# Altium schematic sheet 假肢控制电路.SchDoc
size A1
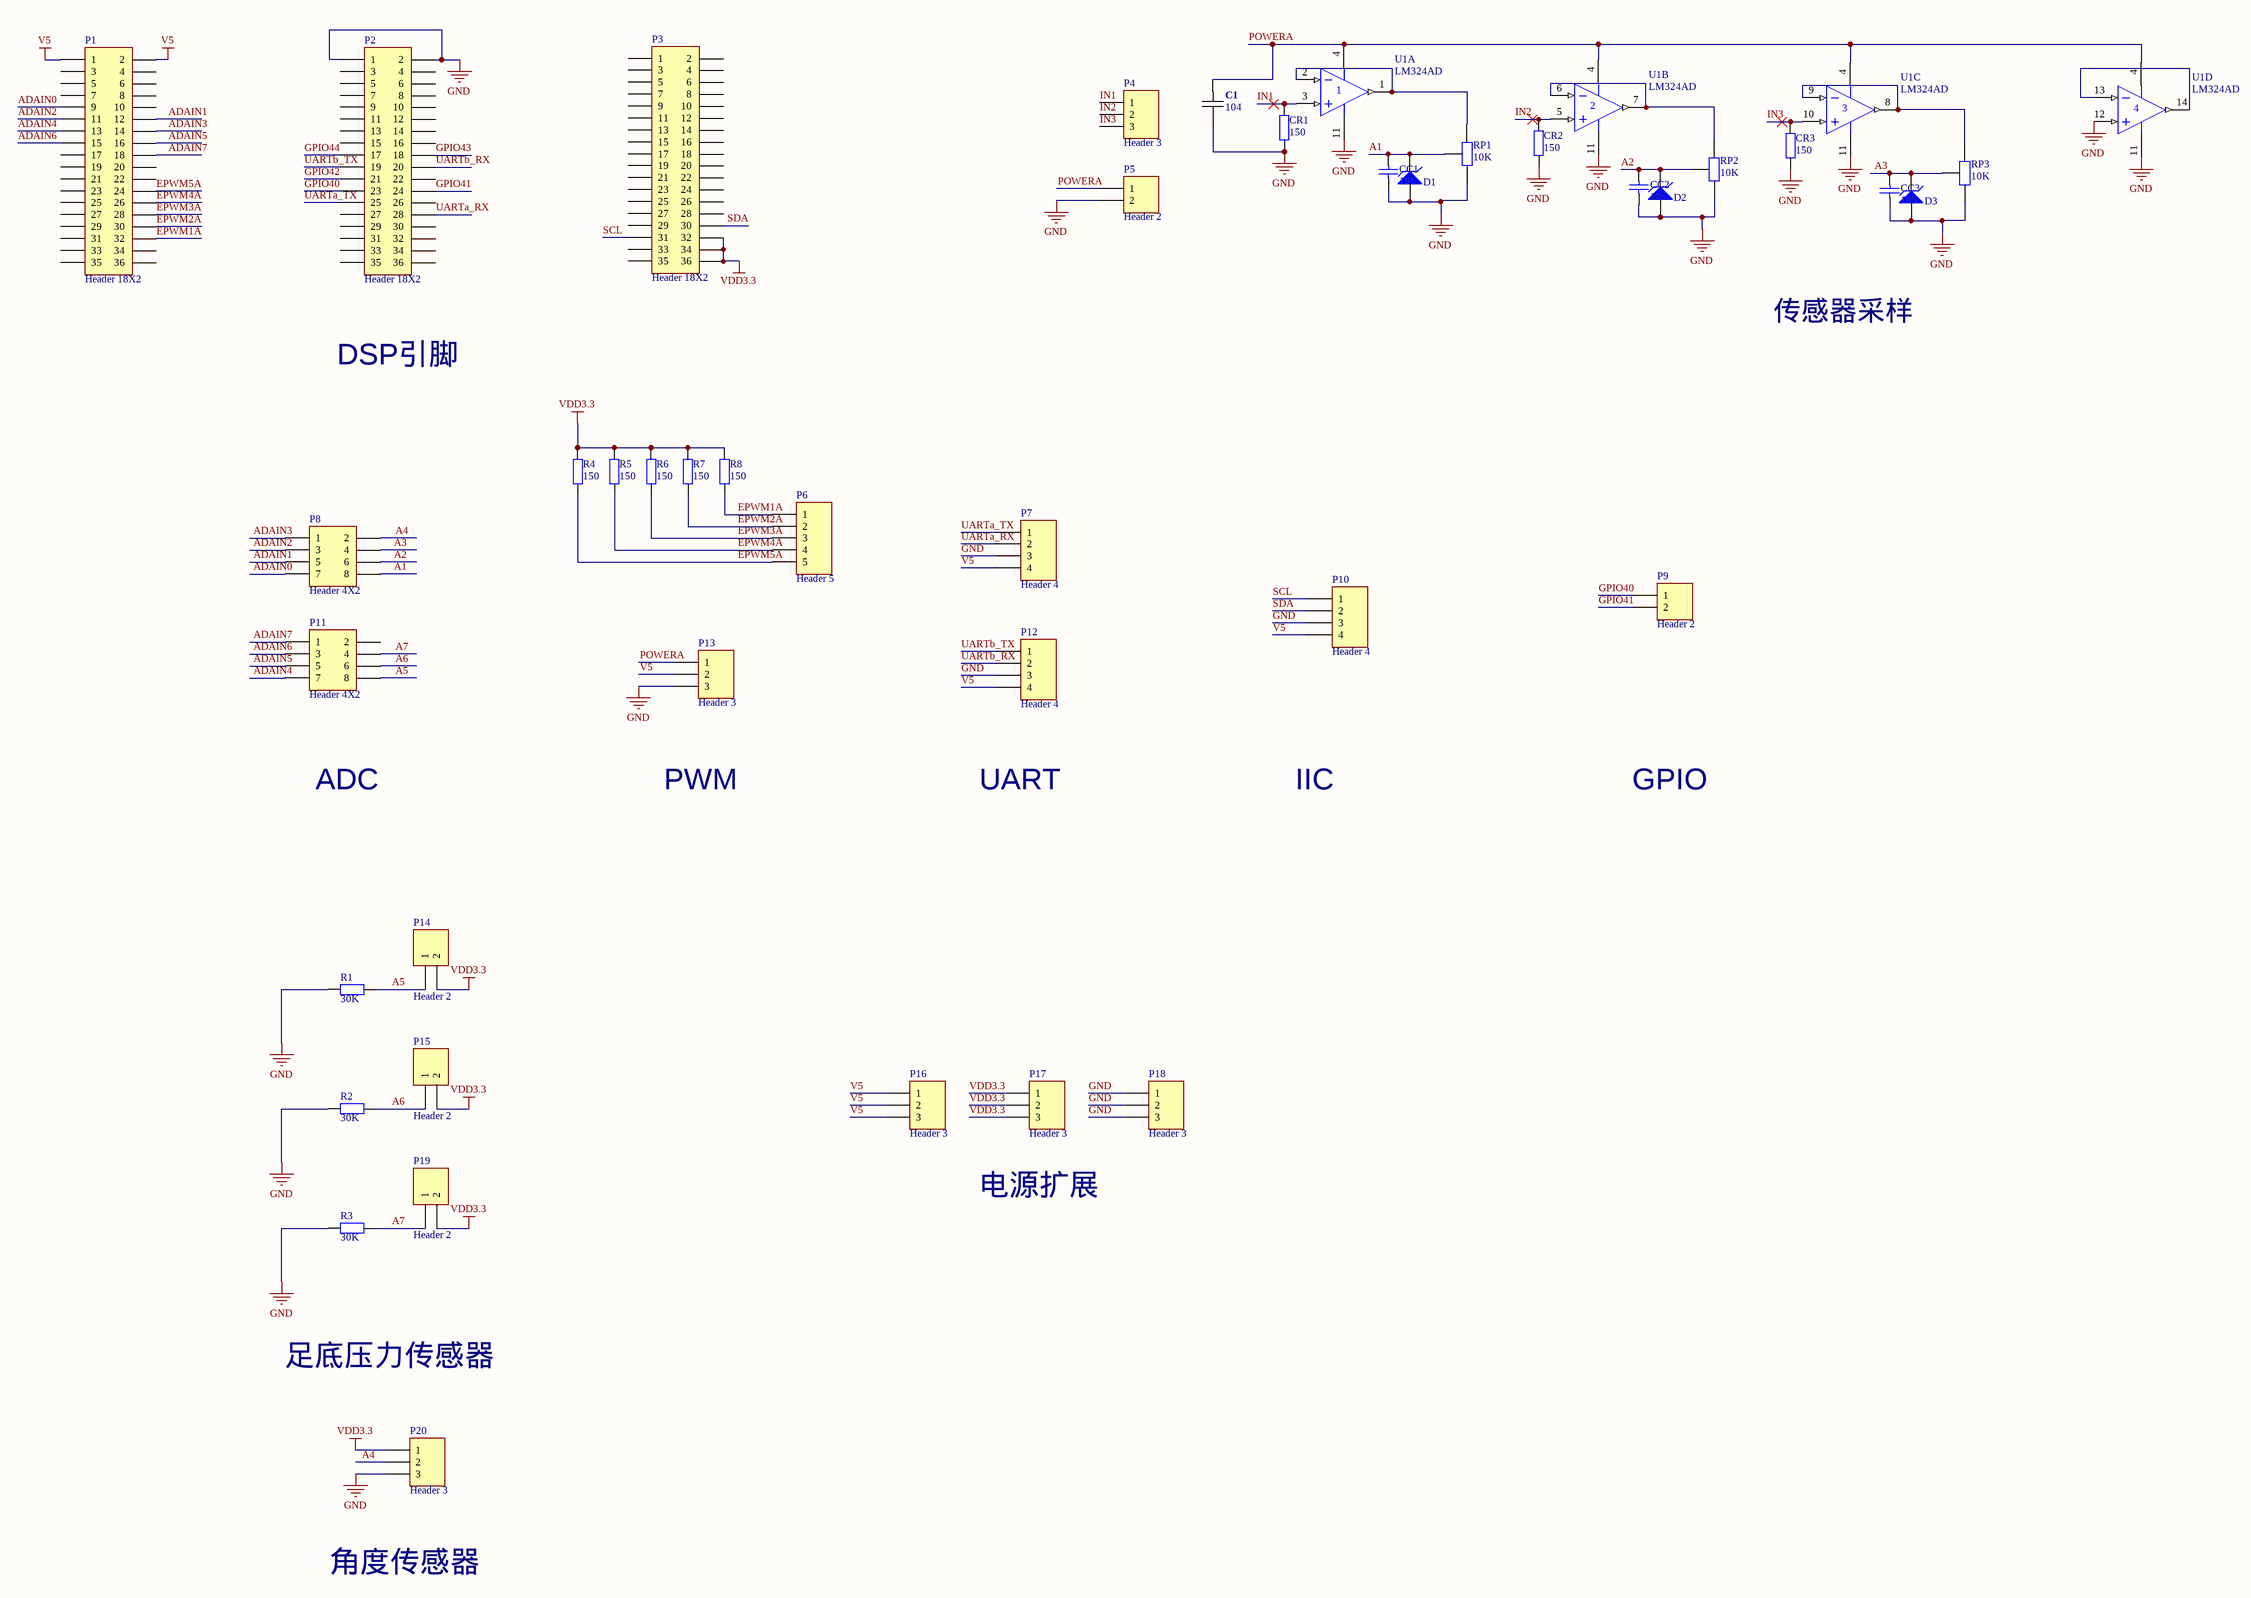
[diagram p0: 假肢控制电路.SchDoc]

## Parts
C1  104  [LC-0805_C]
CC1  105  [LC-0805_C]
CC2  105  [LC-0805_C]
CC3  105  [LC-0805_C]
CR1  150  [LC-0805_R]
CR2  150  [LC-0805_R]
CR3  150  [LC-0805_R]
D1  Diode  Zener  [LC-1206]  (value not drawn)
D2  Diode  Zener  [LC-1206]  (value not drawn)
D3  Diode  Zener  [LC-1206]  (value not drawn)
P1  Header 18X2  [HDR2X18]
P2  Header 18X2  [HDR2X18]
P3  Header 18X2  [HDR2X18]
P4  Header 3  [XH2.54-3]
P5  Header 2  [XH2.54-2]
P6  Header 5  [XH2.54-LI-5P]
P7  Header 4  [HDR1X4]
P8  Header 4X2  [HDR2X4]
P9  Header 2  [HDR1X2]
P10  Header 4  [KF2EDGK5.0-LI-4P]
P11  Header 4X2  [HDR2X4]
P12  Header 4  [HDR1X4]
P13  Header 3  [XH2.54-LI-3P]
P14  Header 2  [XH2.54-2]
P15  Header 2  [XH2.54-2]
P16  Header 3  [HDR1X3]
P17  Header 3  [HDR1X3]
P18  Header 3  [HDR1X3]
P19  Header 2  [XH2.54-2]
P20  Header 3  [XH2.54-3]
R1  value 30K  [LC-0805_R]  (hidden comment: 3.3K)
R2  value 30K  [LC-0805_R]  (hidden comment: 3.3K)
R3  value 30K  [LC-0805_R]  (hidden comment: 3.3K)
R4  150  [LC-0805_R]
R5  150  [LC-0805_R]
R6  150  [LC-0805_R]
R7  150  [LC-0805_R]
R8  150  [LC-0805_R]
RP1  10K  [VR5]
RP2  10K  [VR5]
RP3  10K  [VR5]
U1  LM324AD  [SO-14]  (parts A,B,C,D of 4)

## Nets
GND: C1.2 CC1.1 CC2.1 CC3.1 CR1.2 CR2.2 CR3.2 D1.1(A) D2.1(A) D3.1(A) P2.1 P2.2 P5.2 P7.3 P10.3 P12.3 P13.3 P18.1 P18.2 P18.3 P20.3 R1.2 R2.2 R3.2 RP1.1 RP2.1 RP3.1 U1.11(V-) U1.12(IN+)
V5: P1.1 P1.2 P7.4 P10.4 P12.4 P13.2 P16.1 P16.2 P16.3
VDD3.3: P3.32 P3.34 P3.36 P14.2 P15.2 P17.1 P17.2 P17.3 P19.2 P20.1 R4.1 R5.1 R6.1 R7.1 R8.1
A1: CC1.2 D1.2(K) P8.8 RP1.2
A2: CC2.2 D2.2(K) P8.6 RP2.2
A3: CC3.2 D3.2(K) P8.4 RP3.2
A4: P8.2 P20.2
A5: P11.8 P14.1 R1.1
A6: P11.6 P15.1 R2.1
A7: P11.4 P19.1 R3.1
ADAIN0: P1.9 P8.7
ADAIN1: P1.12 P8.5
ADAIN2: P1.11 P8.3
ADAIN3: P1.14 P8.1
ADAIN4: P1.13 P11.7
ADAIN5: P1.16 P11.5
ADAIN6: P1.15 P11.3
ADAIN7: P1.18 P11.1
EPWM1A: P1.32 P6.1 R8.2
EPWM2A: P1.30 P6.2 R7.2
EPWM3A: P1.28 P6.3 R6.2
EPWM4A: P1.26 P6.4 R5.2
EPWM5A: P1.24 P6.5 R4.2
GPIO40: P2.23 P9.1
GPIO41: P2.24 P9.2
GPIO42: P2.21
GPIO43: P2.18
GPIO44: P2.17
IN1: CR1.1 P4.1 U1.3(IN+)
IN2: CR2.1 P4.2 U1.5(IN+)
IN3: CR3.1 P4.3 U1.10(IN+)
POWERA: C1.1 P5.1 P13.1 U1.4(V+)
SCL: P3.31 P10.1
SDA: P3.30 P10.2
UARTa_RX: P2.28 P7.2
UARTa_TX: P2.25 P7.1
UARTb_RX: P2.20 P12.2
UARTb_TX: P2.19 P12.1
NetRP1_3: RP1.3 U1.1(OUT) U1.2(IN-)
NetRP2_3: RP2.3 U1.6(IN-) U1.7(OUT)
NetRP3_3: RP3.3 U1.8(OUT) U1.9(IN-)
NetU1_13: U1.13(IN-) U1.14(OUT)

Not connected (* = marked no-connect by the designer): P1 3 4 5 6 7 8 10 17 19 20 21 22 23 25 27 29 31 33 34 35 36; P2 3 4 5 6 7 8 9 10 11 12 13 14 15 16 22 26 27 29 30 31 32 33 34 35 36; P3 1 2 3 4 5 6 7 8 9 10 11 12 13 14 15 16 17 18 19 20 21 22 23 24 25 26 27 28 29 33 35; P11 2

## Notes on the sheet
- 传感器采样
- DSP引脚
- ADC
- PWM
- UART
- IIC
- GPIO
- 电源扩展
- 足底压力传感器
- 角度传感器

## Library data of the parts
C1 = CAP(瓷片,104): 1.02.08.0014
CC1-CC3 = Cap Chip 0805: Polarized Capacitor (Radial); Published: 8-Jun-2000; Revision: July-2002: Re-released for DXP Platform.; Publisher: Altium Limited; Value: 105
CR1-CR3 R4-R8 = Resistor Chip 0805: Resistor; Published: 8-Jun-2000; Revision: July-2002: Re-released for DXP Platform.; Publisher: Altium Limited; Value: 150
D1-D3 = Diode  Zener: Zener Diode; Published: 8-Jun-2000; Revision: July-2002: Re-released for DXP Platform.; Publisher: Altium Limited
P1-P3 = Header 18X2: Header, 18-Pin, Dual row; LatestRevisionDate: 17-Jul-2002; LatestRevisionNote: Re-released for DXP Platform.; Publisher: Altium Limited
P4 P13 P16-P18 P20 = Header 3: Header, 3-Pin; LatestRevisionDate: 17-Jul-2002; LatestRevisionNote: Re-released for DXP Platform.; Publisher: Altium Limited
P5 P9 P14 P15 P19 = Header 2: Header, 2-Pin; LatestRevisionDate: 17-Jul-2002; LatestRevisionNote: Re-released for DXP Platform.; Publisher: Altium Limited
P6 = Header 5: Header, 5-Pin; LatestRevisionDate: 17-Jul-2002; LatestRevisionNote: Re-released for DXP Platform.; Publisher: Altium Limited
P7 P10 P12 = Header 4: Header, 4-Pin; LatestRevisionDate: 17-Jul-2002; LatestRevisionNote: Re-released for DXP Platform.; Publisher: Altium Limited
P8 P11 = Header 4X2: Header, 4-Pin, Dual row; LatestRevisionDate: 17-Jul-2002; LatestRevisionNote: Re-released for DXP Platform.; Publisher: Altium Limited
R1-R3 = Res2: Resistor; Published: 8-Jun-2000; LatestRevisionDate: 17-Jul-2002; LatestRevisionNote: Re-released for DXP Platform.; PackageReference: AXIAL-0.4; Publisher: Altium Limited; PackageDescription: Axial Device, Thru-Hole; 2 Leads; 0.4 in Pin Spacing
RP1-RP3 = Res_t
U1 = LM324AD: Quadruple Operational Amplifier; Published: 15-Apr-2002; LatestRevisionDate: 4-Mar-2005; LatestRevisionNote: Stylized 3D Model Added.; DatasheetDocument: Jan-1989; PackageDocument: Jan-1998; PackageReference: D014; Publisher: Altium Limited; ComponentLink1Description: Manufacturer Link; ComponentLink1URL: http://www.ti.com/